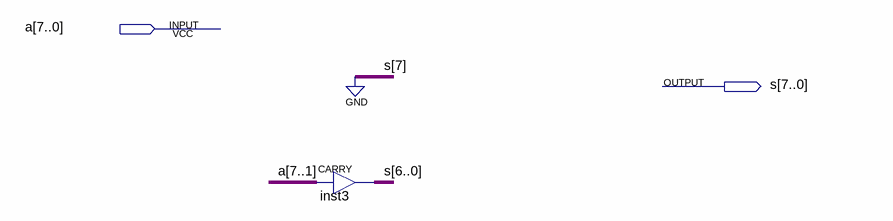
[diagram p0: schematic sheet]
// Quartus schematic 8BShiftr1.bdf as structural Verilog: 1 symbols, 2 pins
module \8BShiftr1  (
  input  [7:0] a,
  output [7:0] s
);

  CARRY inst3[6:0] (.IN(a[7:1]), .OUT(s[6:0]));

  assign s[7] = 1'b0;
endmodule
